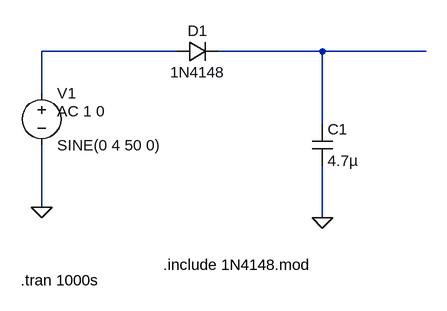
[diagram p0: schematic 4ACto3.3DC(basbar voltage) Version 1.asc]
4ACto3.3DC(basbar voltage) Version 1.asc, the LTspice schematic file:
Version 4
SHEET 1 880 680
WIRE -176 -112 -384 -112
WIRE 48 -112 -112 -112
WIRE 208 -112 48 -112
WIRE -384 -48 -384 -112
WIRE 48 0 48 -112
WIRE -384 128 -384 32
WIRE 48 144 48 64
FLAG -384 128 0
FLAG 48 144 0
SYMBOL diode -176 -96 R270
WINDOW 0 32 32 VTop 2
WINDOW 3 0 32 VBottom 2
SYMATTR InstName D1
SYMATTR Value 1N4148
SYMBOL voltage -384 -64 R0
WINDOW 123 24 44 Left 2
WINDOW 39 0 0 Left 0
SYMATTR Value2 AC 1 0
SYMATTR InstName V1
SYMATTR Value SINE(0 4 50 0)
SYMBOL cap 32 0 R0
SYMATTR InstName C1
SYMATTR Value 4.7µ
TEXT 32 216 Right 2 !.include 1N4148.mod
TEXT -416 240 Left 2 !.tran 1000s

The netlist it stands for:
* 4ACto3.3DC(basbar voltage) Version 1.asc
D1 N001 N002 1N4148
V1 N001 0 SINE(0 4 50 0) AC 1 0
C1 N002 0 4.7µ
.model D D
.lib standard.dio
.include 1N4148.mod
.tran 1000s
.backanno
.end